# EAGLE design layout 1.0 (EAGLE 5.07)
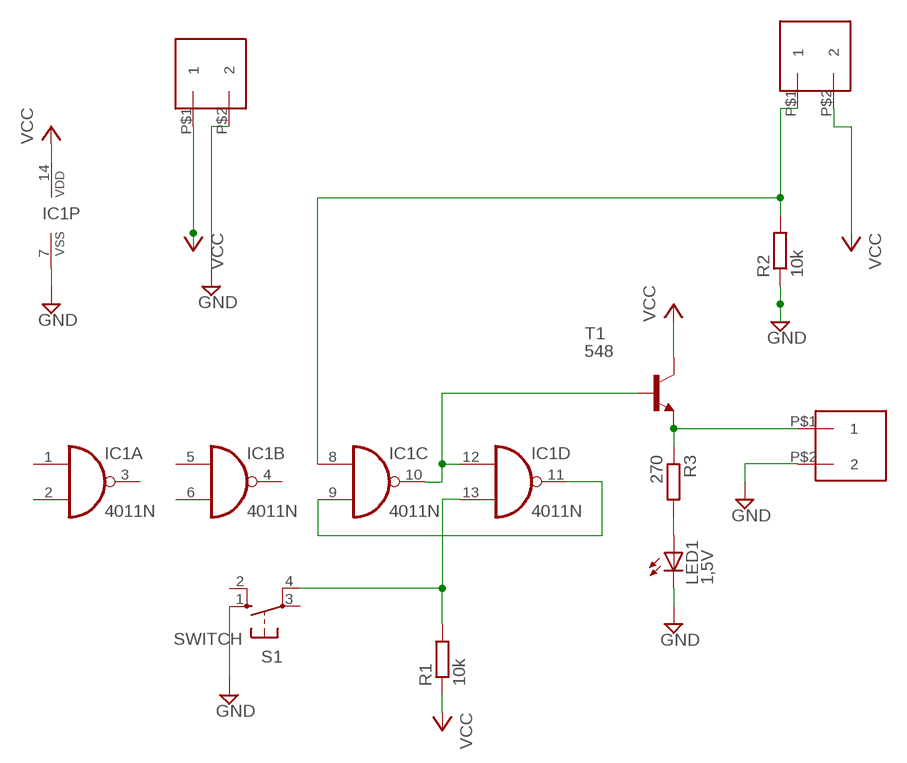
[diagram p0: schematic, sheet 1]

## Parts
BORNE_2_PCI2  BORNE_2_PCI  [BORNE_2_PCI]
BORNE_2_PCI3  BORNE_2_PCI  [BORNE_2_PCI]
BORNE_2_PCI4  BORNE_2_PCI  [BORNE_2_PCI]
IC1  4011N  [DIL14]
LED1  1,5V  LED5MM  [LED5MM]
R1  10k  R-EU_0207/7  [0207/7]
R2  10k  R-EU_0207/7  [0207/7]
R3  270  R-EU_0207/7  [0207/7]
S1  SWITCH  10-XX  [B3F-10XX]
T1  548  BC548B-NPN-TO92-EBC  [TO92-EBC]

## Nets
GND: BORNE_2_PCI2.P$2 BORNE_2_PCI4.P$2 IC1.7(P:VSS) LED1.K(C) R2.1 S1.1(S)
N$1: IC1.9(C:I1) IC1.11(D:O)
N$2: IC1.10(C:O) IC1.12(D:I0) T1.B
N$3: IC1.13(D:I1) R1.2 S1.4(P1)
N$5: BORNE_2_PCI3.P$1 IC1.8(C:I0) R2.2
N$6: BORNE_2_PCI4.P$1 R3.1 T1.E
N$7: LED1.A R3.2
VCC: BORNE_2_PCI2.P$1 BORNE_2_PCI3.P$2 IC1.14(P:VDD) R1.1 T1.C
Unconnected: IC1.1(A:I0) IC1.2(A:I1) IC1.3(A:O) IC1.4(B:O) IC1.5(B:I0) IC1.6(B:I1) S1.2(S1) S1.3(P)

## Library data of the parts
BORNE_2_PCI2-BORNE_2_PCI4 = BORNE_2_PCI:BORNE_2_PCI
IC1 = 40xx:4011: Quad 2-input NAND
LED1 = led:LED: LED OSRAM: - CHIPLED LG R971, LG N971, LY N971, LG Q971, LY Q971, LO R971, LY R971 LH N974, LH R974 LS Q976, LO Q976, LY Q976 LO Q996 - Hyper CHIPLED LW Q18S LB Q993, LB Q99A, LB R99A - SideLED LS A670, LO A670, LY A670, LG A670, LP A670 LB A673, LV A673, LT A673, LW A673 LH A674 LY A675 LS A676, LA A676, LO A676, LY A676, LW A676 LS A679, LY A679, LG A679 - Hyper Micro SIDELED® LS Y876, LA Y876, LO Y876, LY Y876 LT Y87S - SmartLED LW L88C, LW L88S LB L89C, LB L89S, LG L890 LS L89K, LO L89K, LY L89K LS L896, LA L896, LO L896, LY L896 - TOPLED LS T670, LO T670, LY T670, LG T670, LP T670 LSG T670, LSP T670, LSY T670, LOP T670, LYG T670 LG T671, LOG T671, LSG T671 LB T673, LV T673, LT T673, LW T673 LH T674 LS T676, LA T676, LO T676, LY T676, LB T676, LH T676, LSB T676, LW T676 LB T67C, LV T67C, LT T67C, LS T67K, LO T67K, LY T67K, LW E67C LS E67B, LA E67B, LO E67B, LY E67B, LB E67C, LV E67C, LT E67C LW T67C LS T679, LY T679, LG T679 LS T770, LO T770, LY T770, LG T770, LP T770 LB T773, LV T773, LT T773, LW T773 LH T774 LS E675, LA E675, LY E675, LS T675 LS T776, LA T776, LO T776, LY T776, LB T776 LHGB T686 LT T68C, LB T68C - Hyper Mini TOPLED® LB M676 - Mini TOPLED Santana® LG M470 LS M47K, LO M47K, LY M47K Source: http://www.osram.convergy.de LUXEON: - LUMILED® LXK2-PW12-R00, LXK2-PW12-S00, LXK2-PW14-U00, LXK2-PW14-V00 LXK2-PM12-R00, LXK2-PM12-S00, LXK2-PM14-U00 LXK2-PE12-Q00, LXK2-PE12-R00, LXK2-PE12-S00, LXK2-PE14-T00, LXK2-PE14-U00 LXK2-PB12-K00, LXK2-PB12-L00, LXK2-PB12-M00, LXK2-PB14-N00, LXK2-PB14-P00, LXK2-PB14-Q00 LXK2-PR12-L00, LXK2-PR12-M00, LXK2-PR14-Q00, LXK2-PR14-R00 LXK2-PD12-Q00, LXK2-PD12-R00, LXK2-PD12-S00 LXK2-PH12-R00, LXK2-PH12-S00 LXK2-PL12-P00, LXK2-PL12-Q00, LXK2-PL12-R00 Source: www.luxeon.com KINGBRIGHT: KA-3528ASYC Source: www.kingbright.com
R1-R3 = rcl:R-EU_: RESISTOR, European symbol
S1 = switch-omron:10-XX: OMRON SWITCH
T1 = transistor:*-NPN-: NPN Transistror BF959 corrected 2008.03.06

## Board
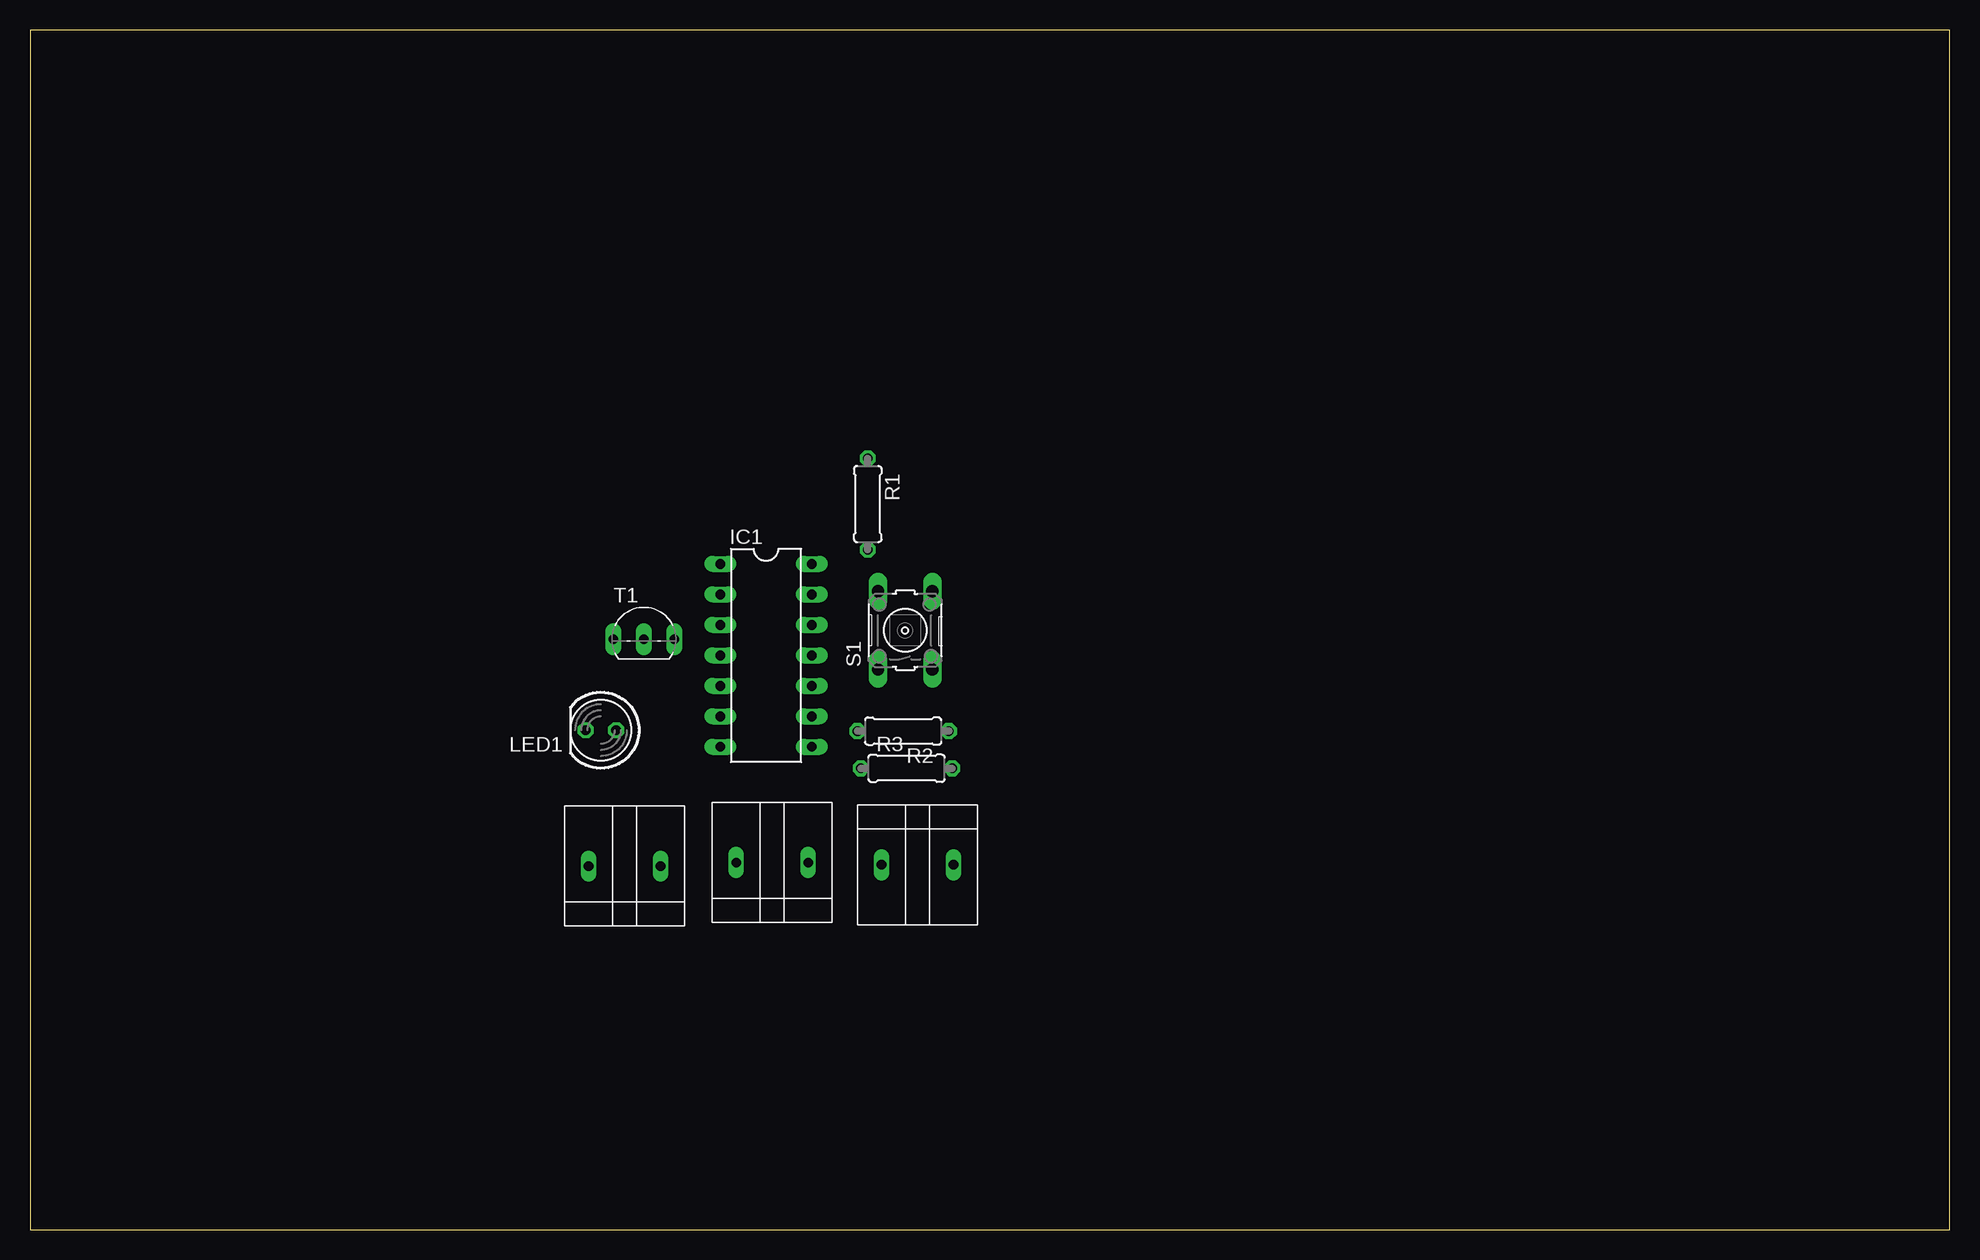
[diagram p1: board, top side]
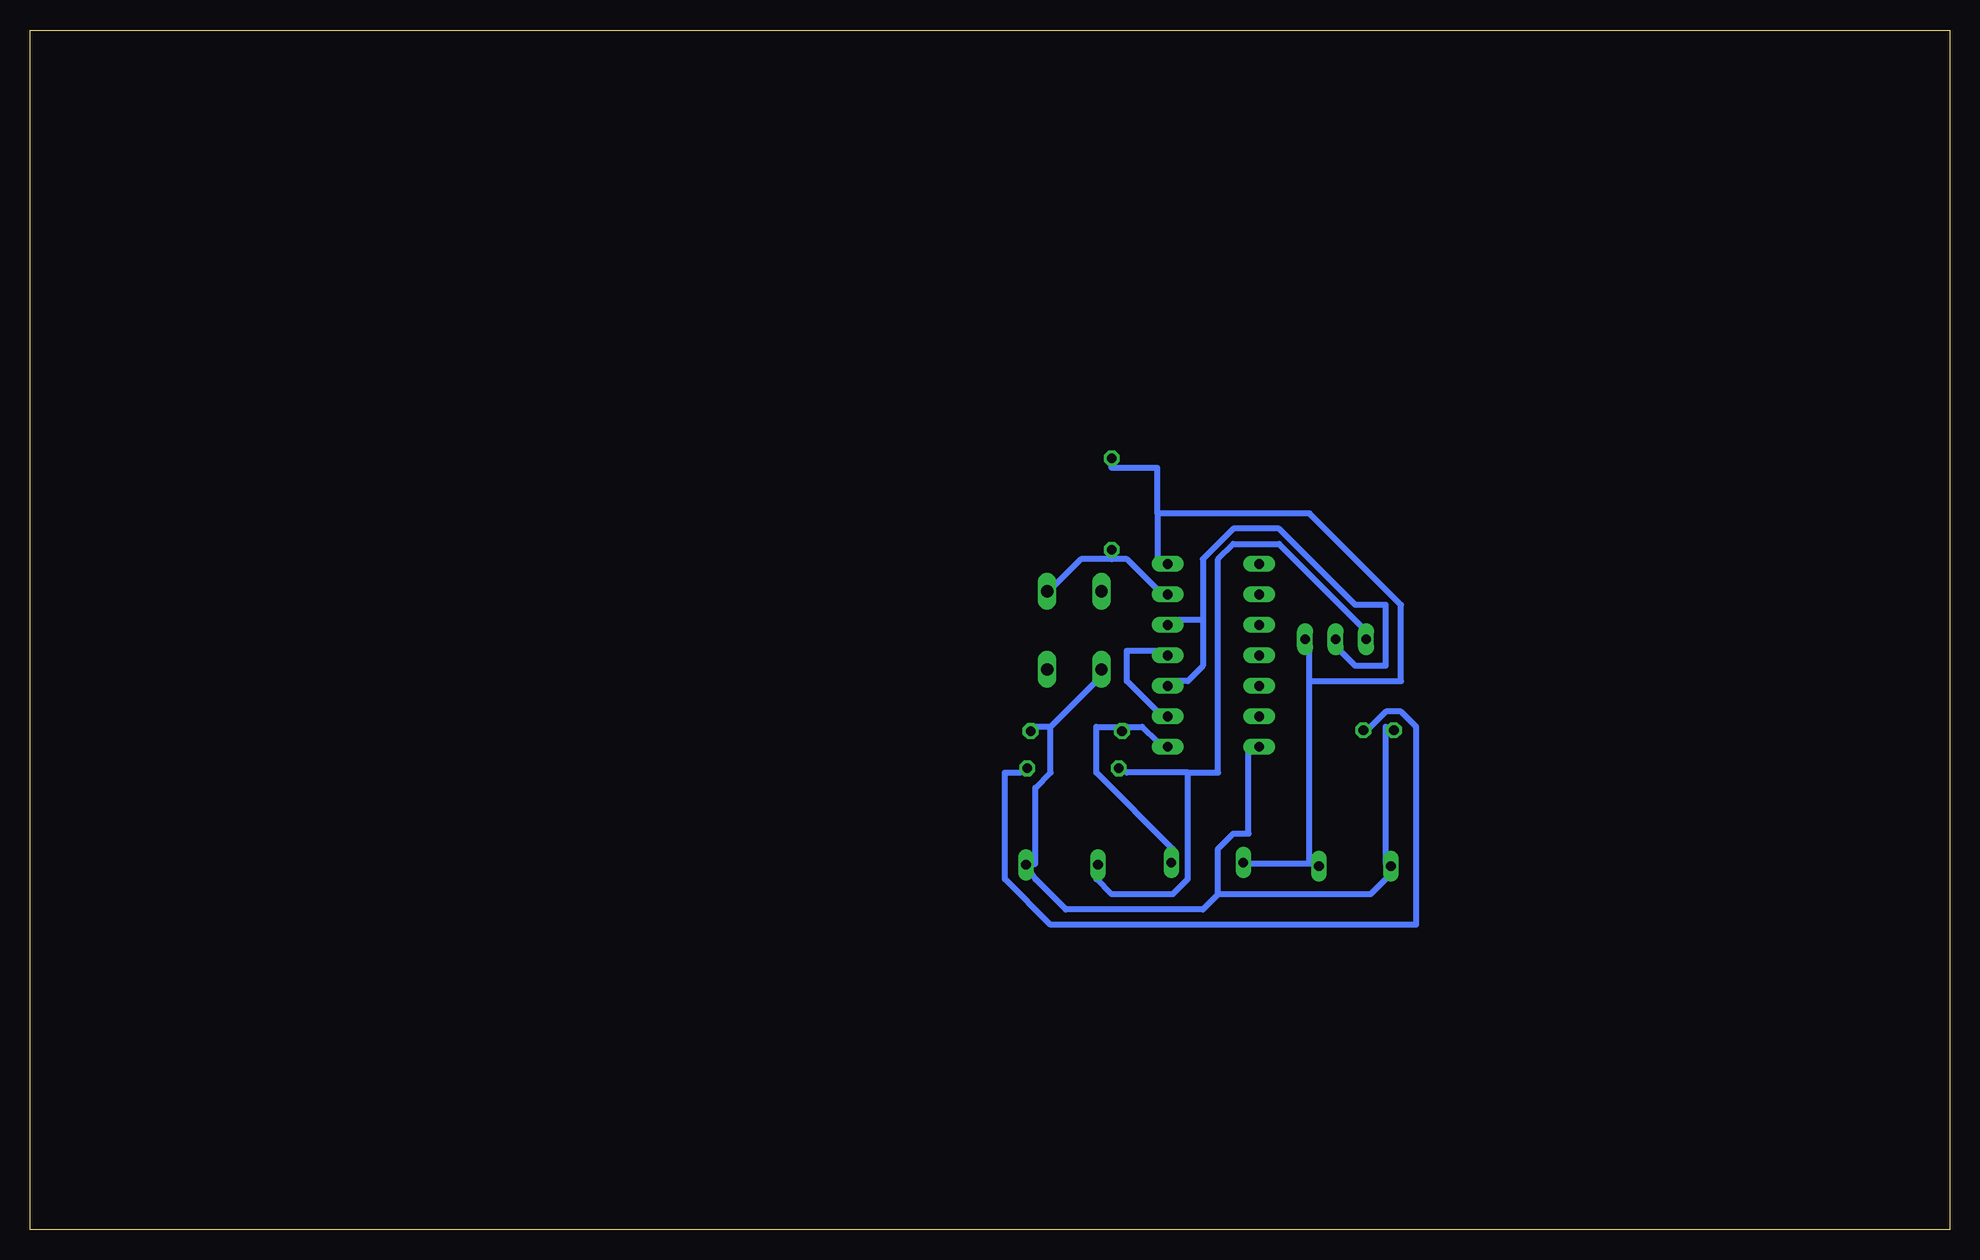
[diagram p2: board, bottom side, seen from below]

Size 160 x 100 mm. Coordinates in mm from the lower left corner, seen from the top.
Outline: 0,0 160,0 160,100 0,100 0,0
Copper layers (1*16): Top 0.035mm / dielectric 1.5mm / Bottom 0.035mm
Design rules "default *": minimum track width 20mil, minimum drill 24mil, track to track 8mil, track to pad 8mil, pad to pad 8mil, via to via 8mil, smd to smd 8mil, copper to edge 40mil, drill to drill 8mil, minimum pad ring 10mil, minimum via ring 8mil, stop-mask expansion 4mil, vias tented up to drill 0mil, thermal gap 10mil

### Footprints (pad centres in the part's own frame; a part is rotated, then mirrored left to right if it is on the bottom)
BORNE_2_PCI = drill 0.8 long: P$1 -3.08,-0.08; P$2 2.92,-0.08
DIL14 = drill 0.813 long: 1 -7.62,-3.81; 2 -5.08,-3.81; 3 -2.54,-3.81; 4 0,-3.81; 5 2.54,-3.81; 6 5.08,-3.81; 7 7.62,-3.81; 8 7.62,3.81; 9 5.08,3.81; 10 2.54,3.81; 11 0,3.81; 12 -2.54,3.81; 13 -5.08,3.81; 14 -7.62,3.81
LED5MM = drill 0.813 octagon: A -1.27,0; K 1.27,0
0207/7 = drill 0.813 octagon: 1 -3.81,0; 2 3.81,0
B3F-10XX = drill 1.016 long: 1 -3.251,2.261; 2 3.251,2.261; 3 -3.251,-2.261; 4 3.251,-2.261
TO92-EBC = drill 0.813 long: B 0,-1.27; C 2.54,-1.27; E -2.54,-1.27

### Placement (x,y rotation side)
BORNE_2_PCI2  49.48,30.22 180 top
BORNE_2_PCI3  61.78,30.52 180 top
BORNE_2_PCI4  74.06,30.48 0 top
IC1  61.35,47.86 270 top
LED1  47.59,41.63 180 top
R1  69.83,60.48 270 top
R2  72.78,41.55 180 top
R3  73.06,38.45 0 top
S1  72.95,49.95 90 top
T1  51.17,50.48 0 top

### Tracks (layer width: path | path; a pad name or v marks a point on that pad's centre or on a via)
GND
  Bottom 0.508: 74.93,41.91 74.93,38.1 76.2,36.83 76.2,30.48 BORNE_2_PCI4.P$2 76.2,29.21 73.66,26.67 62.23,26.67 60.96,27.94 | 74.93,41.91 76.2,41.91 R2.1 | 74.93,41.91 71.12,45.72 S1.1 | LED1.K 46.99,41.91 46.99,30.48 BORNE_2_PCI2.P$2 46.99,29.21 48.26,27.94 60.96,27.94 | 60.96,27.94 60.96,31.75 59.69,33.02 58.42,33.02 58.42,40.64 IC1.7
N$1
  Bottom 0.508: IC1.9 66.04,43.18 68.58,45.72 68.58,48.26 66.04,48.26 IC1.11
N$2
  Bottom 0.508: 62.23,50.8 62.23,46.99 63.5,45.72 64.77,45.72 IC1.10 | 62.23,50.8 64.77,50.8 IC1.12 | 62.23,50.8 62.23,55.88 59.69,58.42 55.88,58.42 49.53,52.07 46.99,52.07 46.99,46.99 49.53,46.99 50.8,48.26 T1.B
N$3
  Bottom 0.508: 69.85,55.88 68.58,55.88 66.04,53.34 IC1.13 | 69.85,55.88 72.39,55.88 74.93,53.34 S1.4 | 69.85,55.88 R1.2
N$5
  Bottom 0.508: 68.58,41.91 71.12,41.91 71.12,38.1 64.77,31.75 BORNE_2_PCI3.P$1 | 68.58,41.91 67.31,41.91 66.04,40.64 IC1.8 | 68.58,41.91 R2.2
N$6
  Bottom 0.508: 63.5,38.1 63.5,29.21 64.77,27.94 69.85,27.94 71.12,29.21 BORNE_2_PCI4.P$1 | 63.5,38.1 68.58,38.1 R3.1 | 63.5,38.1 60.96,38.1 60.96,55.88 59.69,57.15 55.88,57.15 48.26,49.53 T1.E
N$7
  Bottom 0.508: LED1.A 48.26,41.91 46.99,43.18 45.72,43.18 44.45,41.91 44.45,25.4 74.93,25.4 78.74,29.21 78.74,38.1 77.47,38.1 R3.2
VCC
  Bottom 0.508: 66.04,59.69 66.04,63.5 69.85,63.5 R1.1 | 66.04,59.69 66.04,55.88 IC1.14 | 53.34,30.48 58.42,30.48 BORNE_2_PCI3.P$2 | 53.34,30.48 53.34,45.72 | 53.34,45.72 53.34,48.26 T1.C | BORNE_2_PCI2.P$1 53.34,30.48 | 66.04,59.69 53.34,59.69 45.72,52.07 45.72,45.72 53.34,45.72